# Altium schematic sheet AVALON2_power_21b.SchDoc
size A4
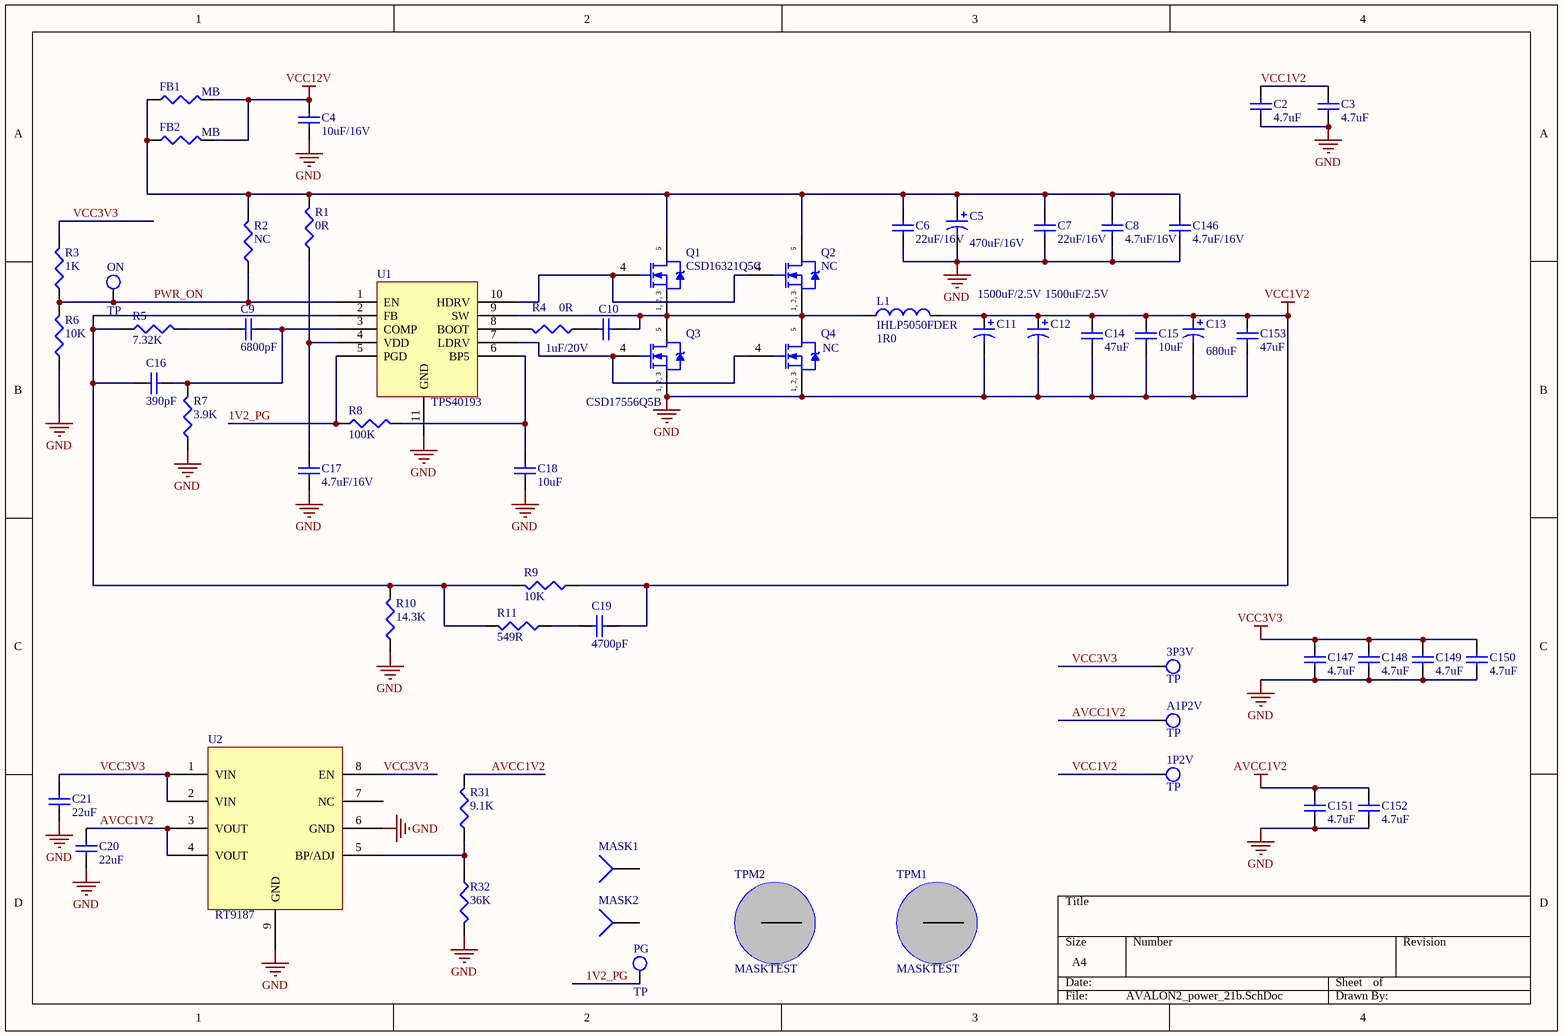
[diagram p0: AVALON2_power_21b.SchDoc]

## Parts
1P2V  TP  [TP]
3P3V  TP  [TP]
A1P2V  TP  [TP]
C2  4.7uF  [CAPC1608L]
C3  4.7uF  [CAPC1608L]
C4  10uF/16V  [CAPC3216L]
C5  470uF/16V  [E12]
C6  22uF/16V  [CAPC3225L]
C7  22uF/16V  [CAPC3225L]
C8  4.7uF/16V  [CAPC2012L]
C9  6800pF  [CAPC1608L]
C10  1uF/20V  [CAPC1608L]
C11  1500uF/2.5V  [E12]
C12  1500uF/2.5V  [E12]
C13  680uF  [D]
C14  47uF  [CAPC3225L]
C15  10uF  [CAPC2012L]
C16  390pF  [CAPC1608L]
C17  4.7uF/16V  [CAPC2012L]
C18  10uF  [CAPC2012L]
C19  4700pF  [CAPC1608L]
C20  22uF  [CAPC3216L]
C21  22uF  [CAPC3216L]
C146  4.7uF/16V  [CAPC2012L]
C147  4.7uF  [CAPC1608L]
C148  4.7uF  [CAPC1608L]
C149  4.7uF  [CAPC1608L]
C150  4.7uF  [CAPC1608L]
C151  4.7uF  [CAPC1608L]
C152  4.7uF  [CAPC1608L]
C153  47uF  [CAPC3225L]
FB1  MB  [INDC3216L]
FB2  MB  [INDC3216L]
L1  IHLP5050FDER  value 1R0  [IHLP5050]
MASK1  Socket  [MASK_LT]  (value not drawn)
MASK2  Socket  [MASK_LT]  (value not drawn)
ON  TP  [TP]
PG  TP  [TP]
Q1  CSD16321Q5C  [Q5C]
Q2  NC  [Q5C]
Q3  CSD17556Q5B  [Q5B]
Q4  NC  [Q5B]
R1  0R  [RESC1608L]
R2  NC  [RESC1005L]
R3  1K  [RESC1005L]
R4  0R  [RESC1608L]
R5  7.32K  [RESC1608L]
R6  10K  [RESC1608L]
R7  3.9K  [RESC1608L]
R8  100K  [RESC1005L]
R9  10K  [RESC1608L]
R10  14.3K  [RESC1608L]
R11  549R  [RESC1608L]
R31  9.1K  [RESC1608L]
R32  36K  [RESC1608L]
TPM1  MASKTEST  [MASKTEST]
TPM2  MASKTEST  [MASKTEST]
U1  TPS40193  [SON10]
U2  RT9187  [DFN-MF8]

## Nets
AVCC1V2: A1P2V.1(TP) C20.2 C151.2 C152.2 R31.2 U2.3(VOUT) U2.4(VOUT)
GND: C2.1 C3.1 C4.1 C5.2 C6.1 C7.1 C8.1 C11.2 C12.2 C13.2 C14.1 C15.1 C17.1 C18.2 C20.1 C21.2 C146.1 C147.1 C148.1 C149.1 C150.1 C151.1 C152.1 C153.1 Q3.1(S) Q3.2(S) Q3.3(S) Q4.1(S) Q4.2(S) Q4.3(S) R6.1 R7.1 R10.1 R32.2 U1.11(GND) U2.6(GND) U2.9(GND)
VCC1V2: 1P2V.1(TP) C2.2 C3.2 C11.1 C12.1 C13.1 C14.2 C15.2 C19.2 C153.2 L1.2 R9.1
VCC3V3: 3P3V.1(TP) C21.1 C147.2 C148.2 C149.2 C150.2 R3.2 U2.1(VIN) U2.2(VIN) U2.8(EN)
VCC12V: C4.2 FB1.2 FB2.2
1V2_PG: PG.1(TP) R8.1 U1.5(PGD)
PWR_ON: ON.1(TP) R2.1 R3.1 R6.2 U1.1(EN)
NetC5_1: C5.1 C6.2 C7.2 C8.2 C146.2 FB1.1 FB2.1 Q1.5(D) Q2.5(D) R1.2 R2.2
NetC9_1: C9.1 C16.1 R7.2 U1.3(COMP)
NetC9_2: C9.2 R5.2
NetC10_1: C10.1 L1.1 Q1.1(S) Q1.2(S) Q1.3(S) Q2.1(S) Q2.2(S) Q2.3(S) Q3.5(D) Q4.5(D) U1.9(SW)
NetC10_2: C10.2 R4.1
NetC16_2: C16.2 R5.1 R9.2 R10.2 R11.2 U1.2(FB)
NetC17_2: C17.2 R1.1 U1.4(VDD)
NetC18_1: C18.1 R8.2 U1.6(BP5)
NetC19_1: C19.1 R11.1
NetQ1_4: Q1.4(G) Q2.4(G) U1.10(HDRV)
NetQ3_4: Q3.4(G) Q4.4(G) U1.7(LDRV)
NetR4_2: R4.2 U1.8(BOOT)
NetR31_1: R31.1 R32.1 U2.5(BP/ADJ)

Not connected (* = marked no-connect by the designer): MASK1 1; MASK2 1; TPM1 0(MASKTEST); TPM2 0(MASKTEST); U2 7(NC)

## Notes on the sheet
- (in symbol HAT216X) 1, 2, 3

## Library data of the parts
C2-C4 C6-C10 C14-C21 C146-C153 = Cap Semi: Capacitor (Semiconductor SIM Model); Published: 8-Jun-2000; LatestRevisionDate: 29-May-2009; LatestRevisionNote: IPC-7351 Footprint Added.; PackageReference: C1206; Publisher: Altium Limited; PackageDescription: Chip Capacitor
  C2 C3 C147-C152: Value: 4.7uF
  C4: Value: 10uF/16V
  C6 C7: Value: 22uF/16V
  C8 C17 C146: Value: 4.7uF/16V
  C9: Value: 6800pF
  C10: Value: 1uF/20V
  C14 C153: Value: 47uF
  C15 C18: Value: 10uF
  C16: Value: 390pF
  C19: Value: 4700pF
  C20 C21: Value: 22uF
C5 C11 C12 = Cap Pol1: Polarized Capacitor (Radial); Published: 8-Jun-2000; LatestRevisionDate: 17-Jul-2002; LatestRevisionNote: Re-released for DXP Platform.; PackageReference: RB7.6-15; Publisher: Altium Limited; PackageDescription: Polarized Capacitor (Radial); 2 Leads
  C5: Value: 470uF/16V
  C11 C12: Value: 1500uF/2.5V
C13 = Cap Pol3: Polarized Capacitor (Surface Mount); Published: 8-Jun-2000; LatestRevisionDate: 29-May-2009; LatestRevisionNote: IPC-7351 Footprint Added.; PackageReference: C0805; Publisher: Altium Limited; PackageDescription: Chip Capacitor; Value: 680uF
FB1 FB2 R1-R11 R31 R32 = Res3: Resistor; Published: 8-Jun-2000; LatestRevisionDate: 29-May-2009; LatestRevisionNote: IPC-7351 Footprint Added.; PackageReference: J1-0603; Publisher: Altium Limited; PackageDescription: Chip Resistor
  FB1 FB2: Value: MB
  R1 R4: Value: 0R
  R2: Value: NC
  R3: Value: 1K
  R5: Value: 7.32K
  R6 R9: Value: 10K
  R7: Value: 3.9K
  R8: Value: 100K
  R10: Value: 14.3K
  R11: Value: 549R
  R31: Value: 9.1K
  R32: Value: 36K
L1 = Inductor: Code_IEC: 1005; Published: 8-Jun-2000; LatestRevisionDate: 29-May-2009; LatestRevisionNote: IPC-7351 Footprint Added.; PackageReference: 0402-A; Publisher: Altium Limited; PackageDescription: Chip Inductor; Code_JEITA: 0402
MASK1 MASK2 = Socket: pin to pad: 1>0; LatestRevisionDate: 17-Jul-2002; LatestRevisionNote: Re-released for DXP Platform.; Publisher: Altium Limited
Q1-Q4 = HAT216X
U2 = RT9187: 1A, Ultra-Low Dropout, Ultra-Fast CMOS LDO Regulator